# Altium schematic sheet FPGA1.SchDoc
size A4; SheetNumber: 2; SheetTotal: 9
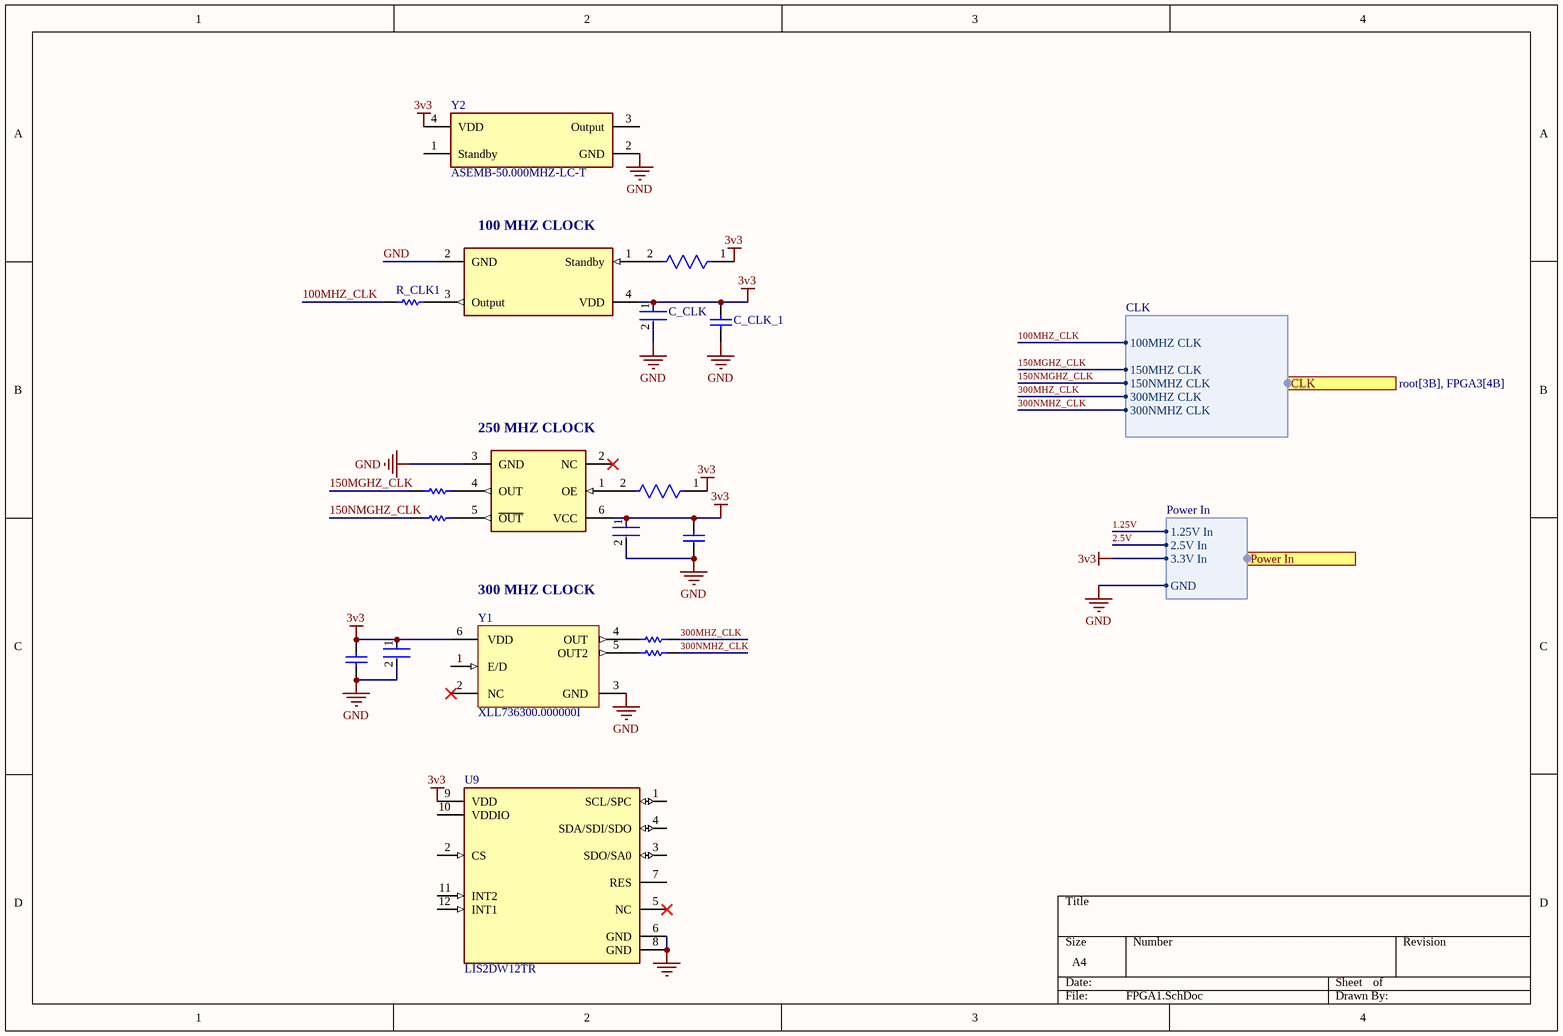
[diagram p0: FPGA1.SchDoc]

## Parts
100MHZ_CLK  ASEM1-100.000MHZ-LC-T  [FP-ASEM-MFG]  (value not drawn)
250_MHZ_CLK  SG3225VAN 250.000000M-KEGA3  [FP-SG3225-MFG]  (value not drawn)
C_CLK  GRM033C71C104KE14D  [FP-GRM033-0_03-MFG]  (value not drawn)
C_CLK_1  C0805C105K8PACTU  [CAPC2013X145X50NL20T25]  (value not drawn)
C_CLK_3  C0805C105K8PACTU  [CAPC2013X145X50NL20T25]  (value not drawn)
C_CLK_4  GRM033C71C104KE14D  [FP-GRM033-0_03-MFG]  (value not drawn)
C_CLK_t5  C0805C105K8PACTU  [CAPC2013X145X50NL20T25]  (value not drawn)
C_CLKt  GRM033C71C104KE14D  [FP-GRM033-0_03-MFG]  (value not drawn)
R_CLK1  CRCW080522R0JNTA  [RESC2013X50X30NL20T20]  (value not drawn)
R_CLK2  CRCW080522R0JNTA  [RESC2013X50X30NL20T20]  (value not drawn)
R_CLK3  CRCW080522R0JNTA  [RESC2013X50X30NL20T20]  (value not drawn)
R_CLK_4  CRCW080522R0JNTA  [RESC2013X50X30NL20T20]  (value not drawn)
R_CLK_5  CRCW080522R0JNTA  [RESC2013X50X30NL20T20]  (value not drawn)
R_STDBY1  RT0402BRE0710KL  [FP-RT0402-MFG]  (value not drawn)
R_STDBY_2  RT0402BRE0710KL  [FP-RT0402-MFG]  (value not drawn)
U9  LIS2DW12TR  [FP-LGA12-DM00170568-MFG]
Y1  XLL736300.000000I  [JU6_MFG]
Y2  ASEMB-50.000MHZ-LC-T  [FP-ASEMB-MFG]

## Ports
CLK (harness CLK, see root[3B], FPGA3[4B]), Power In (harness Power In, see root[2B], FPGA3[4C], IOs[1D])

## Harnesses
Power In: 1.25V In, 2.5V In, 3.3V In, GND
CLK: 100MHZ CLK, 150MHZ CLK, 150NMHZ CLK, 300MHZ CLK, 300NMHZ CLK

## Nets
3v3: 100MHZ_CLK.4(VDD) 250_MHZ_CLK.6(VCC) C_CLK.1 C_CLK_1.2 C_CLK_3.2 C_CLK_4.1 C_CLK_t5.2 C_CLKt.1 R_STDBY1.1 R_STDBY_2.1 U9.9(VDD) Y1.6(VDD) Y2.4(VDD) ; port Power In.3.3V In
GND: 100MHZ_CLK.2(GND) 250_MHZ_CLK.3(GND) C_CLK.2 C_CLK_1.1 C_CLK_3.1 C_CLK_4.2 C_CLK_t5.1 C_CLKt.2 U9.6(GND) U9.8(GND) Y1.3(GND) Y2.2(GND) ; port Power In.GND
1.25V: port Power In.1.25V In
2.5V: port Power In.2.5V In
100MHZ_CLK: R_CLK1.1 ; port CLK.100MHZ CLK
150MGHZ_CLK: R_CLK2.1 ; port CLK.150MHZ CLK
150NMGHZ_CLK: R_CLK3.1 ; port CLK.150NMHZ CLK
300MHZ_CLK: R_CLK_5.2 ; port CLK.300MHZ CLK
300NMHZ_CLK: R_CLK_4.2 ; port CLK.300NMHZ CLK
Net100MHZ_CLK_1: 100MHZ_CLK.1(Standby) R_STDBY1.2
Net100MHZ_CLK_3: 100MHZ_CLK.3(Output) R_CLK1.2
Net250_MHZ_CLK_1: 250_MHZ_CLK.1(OE) R_STDBY_2.2
Net250_MHZ_CLK_4: 250_MHZ_CLK.4(OUT) R_CLK2.2
Net250_MHZ_CLK_5: 250_MHZ_CLK.5(~{OUT}) R_CLK3.2
NetR_CLK_4_1: R_CLK_4.1 Y1.5(OUT2)
NetR_CLK_5_1: R_CLK_5.1 Y1.4(OUT)

Not connected (* = marked no-connect by the designer): 250_MHZ_CLK 2(NC)*; U9 1(SCL/SPC) 2(CS) 3(SDO/SA0) 4(SDA/SDI/SDO) 5(NC)* 7(RES) 10(VDDIO) 11(INT2) 12(INT1); Y1 1(E/D) 2(NC)*; Y2 1(Standby) 3(Output)

## Notes on the sheet
- (near 100MHZ_CLK) 100 MHZ CLOCK
- (near 250_MHZ_CLK) 250 MHZ CLOCK
- 300 MHZ CLOCK

## Library data of the parts
100MHZ_CLK = CMP-27762-005945-1: MEMS OSC XO 100.0000MHZ CMOS SMD; Min Supply Voltage: 3V; Frequency: 100MHz; Load Capacitance: 15pF; Max Supply Current: 10mA; Operating Supply Voltage: 3.3V; Max Supply Voltage: 3.6V; Frequency Stability: 50ppm; Min Operating Temperature: -40°C; Radiation Hardening: No; Series: Pure Silicon™ ASEM; Lead Free: Lead Free; Width: 0.098inch; Max Operating Temperature: 85°C; Mount: Surface Mount; Packaging: Tape and Reel; Length: 0.126inch; Number of Pins: 4; Height: 0.035inch; Case/Package: SMD/SMT
250_MHZ_CLK = CMP-36405-000003-1: XTAL OSC XO 250.0000MHZ LVDS SMD; Manufacturer: EPSON; Min Supply Voltage: 2.5V; Max Supply Voltage: 3.3V; Frequency: 250MHz; Max Supply Current: 30mA; Device Class L1: Passive Components; RoHS: TRUE; Lead Free: Yes; Manufacturer Part Number: SG3225VAN 250.000000M-KEGA3; Height: 1.2mm; Temperature: -40°C to +85°C; Mouser Description: Standard Clock Oscillators 250MHz 30ppm -40C +85C; Automotive: No; Temperature Range Low: -40°C; Digikey Description: XTAL OSC XO 250.0000MHZ LVDS SMD; Device Class L2: Crystals / Oscillators; ComponentLink2URL: https://support.epson.biz/td/api/doc_check.php?dl=brief_SG5032VAN&lang=en; Temperature Range High: +85°C; ComponentLink2Description: Datasheet; Series: SG3225; Category: Crys; Octopart: https://octopart.com/sg3225van+250.000000m-kega3-epson-56783964; Package: SG3225; Device Class L3: Oscillators
C_CLK C_CLK_4 C_CLKt = CMP-06035-019037-1: Chip Multilayer Ceramic Capacitors for General Purpose, 0201, 0.10uF, X7S, 22%, 10%, 16V; Capacitance: 100nF; Dielectric: X7S; Tolerance: 10%; Voltage Rating (DC): 16V; Height: 0.3mm; Max Operating Temperature: 125°C; Case Code (Metric): 0603; Termination: SMD/SMT; Min Operating Temperature: -55°C; Mount: Surface Mount; Case/Package: 0201; Weight: 1.2E-05oz; Package Quantity: 15000; Length: 0.024inch; Voltage Rating: 16V; Case Code (Imperial): 0201; Packaging: Tape and Reel; Thickness: 0.013inch; Width: 0.3mm
C_CLK_1 C_CLK_3 C_CLK_t5 = CMP-2007-01022-1: Manufacturer: Kemet; Part Number: C0805C105K8PACTU
R_CLK1-R_CLK3 R_CLK_4 R_CLK_5 = CMP-2001-03694-1: Manufacturer: Vishay Dale; Part Number: CRCW080522R0JNTA
R_STDBY1 R_STDBY_2 = CMP-2002-02973-2: RES SMD 10K OHM 0.1% 1/16W 0402; Manufacturer: Yageo; Power Rating: 0.063W; Resistance: 10KΩ; Temperature Coefficient: 50 ppm/°C; Tolerance: 0.001; Voltage Rating: 50V; Value: 10KΩ; Octopart: https://octopart.com/rt0402bre0710kl-yageo-1416557; Digikey Description: RES SMD 10K OHM 0.1% 1/16W 0402; Category: Res; Temperature Range Low: -55°C; Ipc Land Pattern Name: RESC10050X30; Manufacturer Part Number: RT0402BRE0710KL; Automotive: No; Package: RT0402; Temperature: -55°C to +155°C; Series: RT; Lead Free: Yes; Device Class L3: Chip SMD Resistors; ComponentLink2URL: http://www.yageo.com/documents/recent/PYu-RT_1-to-0.01_RoHS_L_9.pdf; Height: 0.35mm; ComponentLink2Description: Datasheet; RoHS: TRUE; Composition: Thin Film; Device Class L2: Resistors; Device Class L1: Passive Components; Temperature Range High: +155°C; Footprint Url: http://www.yageo.com/exep/pages/download/literatures/PYu-R_Mount_10.pdf; Mouser Description: Res Thin Film 0402 10K Ohm 0.1% 1/16W ±50ppm/°C Molded SMD Paper T/R
U9 = CMP-12175-000006-1: ACCEL 2-16G I2C/SPI 12LGA; Manufacturer: STMicroelectronics; Min Supply Voltage: 1.62V; Operating Supply Current: 0.38-90uA; Sensor Output: I2C,SPI; Accel Resolution: 14bits; Max Supply Voltage: 3.6V; Accel Range: 2/4/8/16g; Height: 0.7mm; Device Class L1: Sensors; RoHS: TRUE; Temperature Range Low: -40°C; Category: IC; Mouser Description: Accelerometer Triple ±2g/±4g/±8g/±16g 1.62V to 3.6V 0.244mg/digit/0.488mg/digit/0.976mg/digit/1.952mg/digit 12-Pin LG...; Digikey Description: ACCEL 2-16G I2C/SPI 12LGA; ComponentLink2URL: https://www.st.com/resource/en/datasheet/lis2dw12.pdf; Automotive: No; Manufacturer Part Number: LIS2DW12TR; Lead Free: Yes; Footprint Url: https://www.st.com/content/ccc/resource/technical/document/technical_note/73/17/9c/16/dd/96/4a/01/CD00134799.pdf/files/CD00134799.pdf/jcr:content/translations/en.CD00134799.pdf; Temperature: -40°C to +85°C; Device Class L3: Accelerometers; Package: LGA12-DM00170568; Temperature Range High: +85°C; Device Class L2: Motion Sensors; Octopart: https://octopart.com/lis2dw12tr-stmicroelectronics-77080925; ComponentLink2Description: Datasheet
Y1 = CMP-00572-106942874-3: Renesas XL Family of Low Phase Noise Quartz-based PLL Oscillators; Min Input Voltage: 3.135V; Max Input Voltage: 3.465V; Max Output Frequency: 999.9MHz; Output Type: LVDS; Height: 1.45mm; ComponentLink1Description: Manufacturer's Website; Case/Package: CLCC; ComponentLink2URL: https://octopart.com/cad-content/api/get-model-datasheet/15189/106942874; ComponentLink2Description: Datasheet URL; RoHS: Compliant; Number of Pins: 6; Mount: Surface Mount; ComponentLink3Description: Manufacturer's Package Drawing; Max Operating Temperature: 85°C; Min Operating Temperature: -40°C; HelpURL: https://octopart.com/cad-content/api/get-model-datasheet/15189/106942874; ComponentLink3URL: https://www.renesas.com/en/document/psc/ju6-package-outline-70-x-50-mm-body-13-mm-thick; ComponentLink1URL: http://www.renesas.com
Y2 = CMP-27762-007622-1: MEMS OSC XO 50.0000MHZ CMOS SMD; Operating Supply Voltage: 3.3V; Frequency Stability: 50ppm; Frequency: 50MHz; Max Supply Voltage: 4V; Load Capacitance: 15pF; Max Supply Current: 16mA; Min Supply Voltage: -300mV; Min Operating Temperature: -40°C; Mount: Surface Mount; Lead Free: Lead Free; Series: Pure Silicon™ ASEMB; Termination: SMD/SMT; Number of Pins: 4; REACH SVHC: No SVHC; Width: 0.098inch; Case/Package: SMD/SMT; Length: 0.126inch; Packaging: Tape and Reel; Max Operating Temperature: 85°C; Height: 0.035inch